# EAGLE schematic Friedman BeOd (EAGLE 9.4.2)
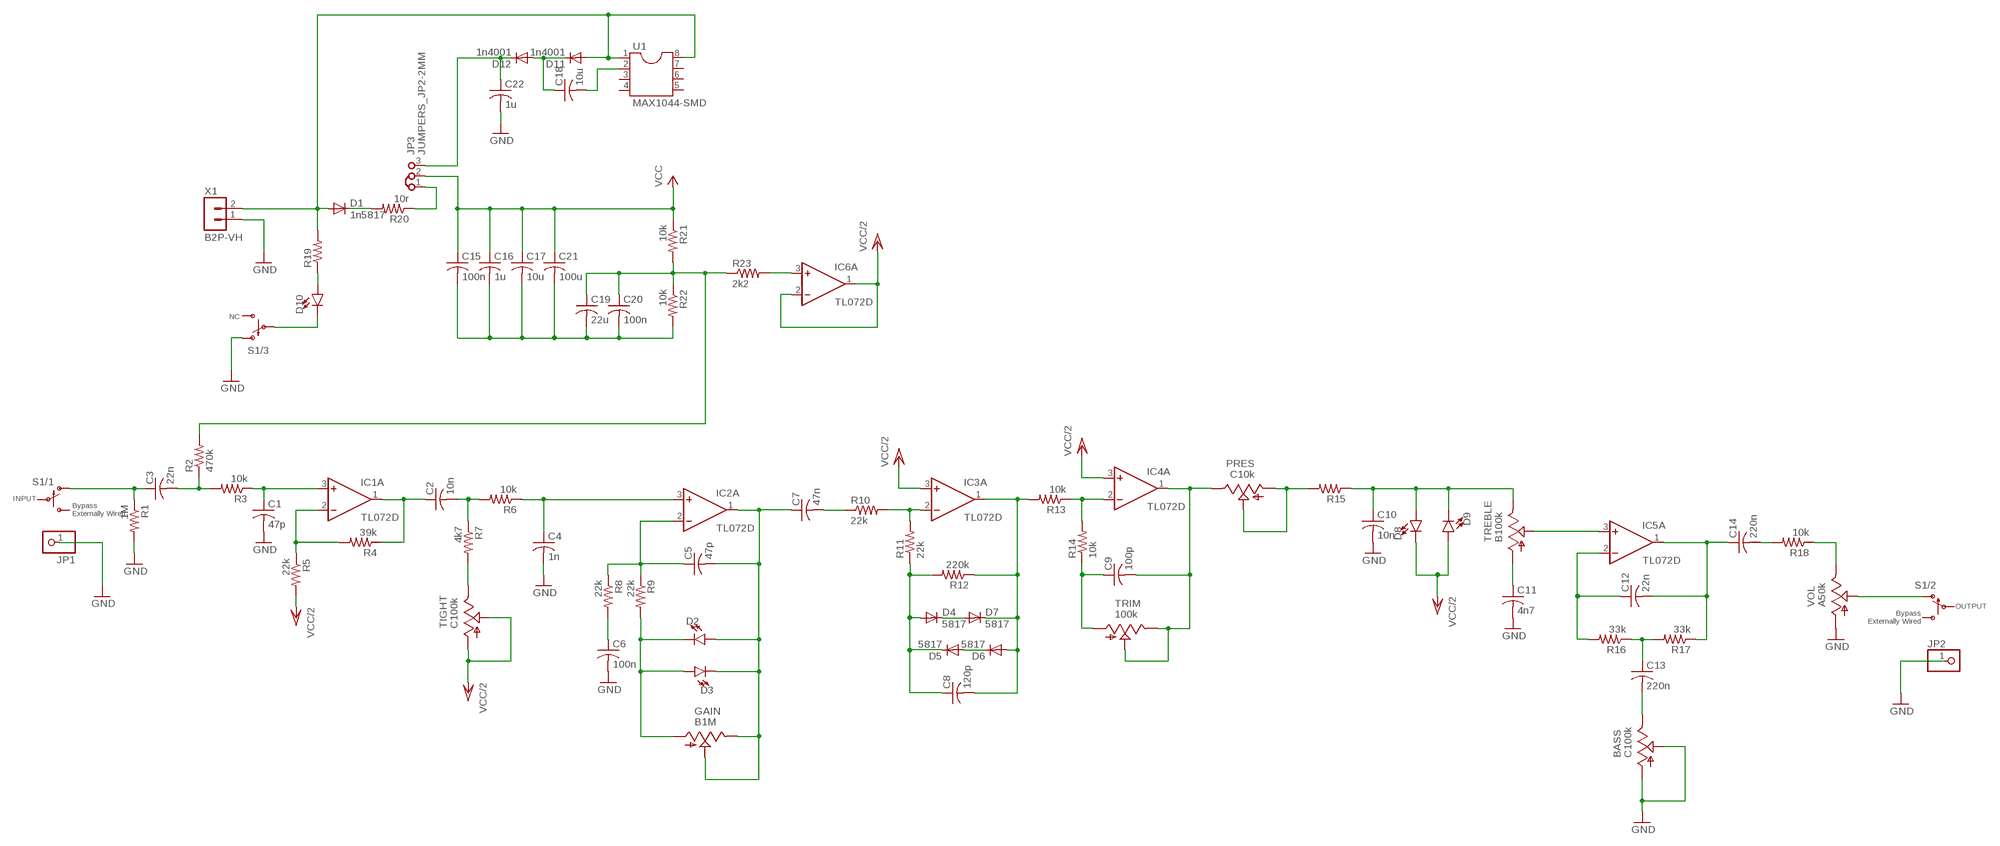
[diagram p0: schematic, sheet 1]

## Parts
BASS  C100k  POT  [61300311121]
C1  47p  C-USC0603  [C0603]
C2  10n  C-USC0603  [C0603]
C3  22n  C-USC0603  [C0603]
C4  1n  C-USC0603  [C0603]
C5  47p  C-USC0603  [C0603]
C6  100n  C-USC0603  [C0603]
C7  47n  C-USC0603  [C0603]
C8  120p  C-USC0603  [C0603]
C9  100p  C-USC0603  [C0603]
C10  10n  C-USC0603  [C0603]
C11  4n7  C-USC0603  [C0603]
C12  22n  C-USC0603  [C0603]
C13  220n  C-USC0603  [C0603]
C14  220n  C-USC0603  [C0603]
C15  100n  C-USC0603  [C0603]
C16  1u  C-USC0603  [C0603]
C17  10u  C-USC0603  [C0603]
C18  10u  C-USC0603  [C0603]
C19  22u  C-USC0603  [C0603]
C20  100n  C-USC0603  [C0603]
C21  100u  C-US075-032X103  [C075-032X103]
C22  1u  C-USC0603  [C0603]
D1  1n5817  1N4004  [DO41-10]
D2  LED3MM  [LED_3MM]
D3  LED3MM  [LED_3MM]
D4  5817  1N4004  [DO41-10]
D5  5817  1N4004  [DO41-10]
D6  5817  1N4004  [DO41-10]
D7  5817  1N4004  [DO41-10]
D8  LED3MM  [LED_3MM]
D9  LED3MM  [LED_3MM]
D10  LED3MM  [LED_3MM]
D11  1n4001  1N4004  [DO41-10]
D12  1n4001  1N4004  [DO41-10]
GAIN  B1M  POT  [61300311121]
IC1  TL072D  [SO08]
IC2  TL072D  [SO08]
IC3  TL072D  [SO08]
IC4  TL072D  [SO08]
IC5  TL072D  [SO08]
IC6  TL072D  [SO08]
JP1  PINHD-1X1  [1X01]
JP2  PINHD-1X1  [1X01]
JP3  JUMPERS_JP2-2MM  [JUMPERS_JP2-2MM]
PRES  C10k  POT  [61300311121]
R1  1M  R-US_R0603  [R0603]
R2  470k  R-US_R0603  [R0603]
R3  10k  R-US_R0603  [R0603]
R4  39k  R-US_R0603  [R0603]
R5  22k  R-US_R0603  [R0603]
R6  10k  R-US_R0603  [R0603]
R7  4k7  R-US_R0603  [R0603]
R8  22k  R-US_R0603  [R0603]
R9  22k  R-US_R0603  [R0603]
R10  22k  R-US_R0603  [R0603]
R11  22k  R-US_R0603  [R0603]
R12  220k  R-US_R0603  [R0603]
R13  10k  R-US_R0603  [R0603]
R14  10k  R-US_R0603  [R0603]
R15  R-US_R0603  [R0603]
R16  33k  R-US_R0603  [R0603]
R17  33k  R-US_R0603  [R0603]
R18  10k  R-US_R0603  [R0603]
R19  R-US_R0603  [R0603]
R20  10r  R-US_R0603  [R0603]
R21  10k  R-US_R0603  [R0603]
R22  10k  R-US_R0603  [R0603]
R23  2k2  R-US_R0603  [R0603]
S1  SWITCH-3DPT-INLINE-BREAKOUT-BYPASS  [1X04]
TIGHT  C100k  POT  [61300311121]
TREBLE  B100k  POT  [61300311121]
TRIM  100k  POT  [61300311121]
U1  MAX1044-SMD  [SO-08]
VOL  A50k  POT  [61300311121]
X1  B2P-VH  [B2P-VH]

## Nets
GND: BASS.1(LEFT) BASS.2(WIPER) C1.2 C4.2 C6.2 C10.2 C11.2 C22.2 JP1.1 JP2.1 R1.2 S1.4(/3:NORMALLY-ON) VOL.1(LEFT) X1.1
N$1: C3.1 R1.1 S1.1(/1:NORMALLY-ON)
N$2: C3.2 R2.1 R3.2
N$3: C1.1 IC1.3(A:+IN) R3.1
N$4: IC1.2(A:-IN) R4.2 R5.1
N$5: C2.1 IC1.1(A:OUT) R4.1
N$6: C2.2 R6.2 R7.1
N$7: R7.2 TIGHT.3(RIGHT)
N$8: S1.2(/2:NORMALLY-ON) VOL.2(WIPER)
N$9: C4.1 IC2.3(A:+IN) R6.1
N$10: C5.1 IC2.2(A:-IN) R8.1 R9.1
N$11: C5.2 C7.1 D2.A D3.K(C) GAIN.2(WIPER) GAIN.3(RIGHT) IC2.1(A:OUT)
N$12: C6.1 R8.2
N$13: D2.K(C) D3.A GAIN.1(LEFT) R9.2
N$14: C8.1 D4.A D5.C R11.1 R12.2
N$15: C7.2 R10.1
N$16: IC3.2(A:-IN) R10.2 R11.2
N$17: C8.2 D6.A D7.C IC3.1(A:OUT) R12.1 R13.2
N$18: D4.C D7.A
N$19: D5.A D6.C
N$20: IC4.2(A:-IN) R13.1 R14.2
N$21: C9.1 R14.1 TRIM.1(LEFT)
N$22: C9.2 IC4.1(A:OUT) PRES.3(RIGHT) TRIM.2(WIPER) TRIM.3(RIGHT)
N$23: PRES.1(LEFT) PRES.2(WIPER) R15.2
N$24: C10.1 D8.A D9.K(C) R15.1 TREBLE.3(RIGHT)
N$25: C11.1 TREBLE.1(LEFT)
N$26: IC5.3(A:+IN) TREBLE.2(WIPER)
N$27: C12.1 IC5.2(A:-IN) R16.2
N$28: C12.2 C14.1 IC5.1(A:OUT) R17.1
N$29: C13.1 R16.1 R17.2
N$30: BASS.3(RIGHT) C13.2
N$31: C14.2 R18.2
N$32: R18.1 VOL.3(RIGHT)
N$33: D10.A R19.1
N$34: D1.C R20.2
N$35: D10.K(C) S1.3(/3:COMMON)
N$36: C15.2 C16.2 C17.2 C19.2 C20.2 C21.2 R22.2
N$37: D1.A D11.A R19.2 U1.1 U1.8 X1.2
N$38: C19.1 C20.1 R2.2 R21.2 R22.1 R23.1
N$39: IC6.3(A:+IN) R23.2
N$40: C18.2 U1.2
N$41: C18.1 D11.C D12.A
N$42: C22.1 D12.C JP3.3
N$43: JP3.1 R20.1
VCC: C15.1 C16.1 C17.1 C21.1 JP3.2 R21.1
VCC/2: D8.K(C) D9.A IC3.3(A:+IN) IC4.3(A:+IN) IC6.1(A:OUT) IC6.2(A:-IN) R5.2 TIGHT.1(LEFT) TIGHT.2(WIPER)
Unconnected: IC1.5(B:+IN) IC1.6(B:-IN) IC1.7(B:OUT) IC2.5(B:+IN) IC2.6(B:-IN) IC2.7(B:OUT) IC3.5(B:+IN) IC3.6(B:-IN) IC3.7(B:OUT) IC4.5(B:+IN) IC4.6(B:-IN) IC4.7(B:OUT) IC5.5(B:+IN) IC5.6(B:-IN) IC5.7(B:OUT) IC6.5(B:+IN) IC6.6(B:-IN) IC6.7(B:OUT) U1.3 U1.4 U1.5 U1.6 U1.7

## Power pins joined to a net without a drawn wire
V+: IC1.8(P:V+) IC2.8(P:V+) IC3.8(P:V+) IC4.8(P:V+) IC5.8(P:V+) IC6.8(P:V+)
V-: IC1.4(P:V-) IC2.4(P:V-) IC3.4(P:V-) IC4.4(P:V-) IC5.4(P:V-) IC6.4(P:V-)

## Library data of the parts
BASS GAIN PRES TIGHT TREBLE TRIM VOL = pedalPartsLibrary:POT
C1-C22 = rcl:C-US: CAPACITOR, American symbol; SPICEPREFIX: C
D1 D4-D7 D11 D12 = adafruit:1N4004: DIODE General purpose 1N400x type rectifier (With bigger pads) http://www.ladyada.net/library/pcb/eaglelibrary.html
D2 D3 D8-D10 = SparkFun-LED:LED: LED (Generic) Standard schematic elements and footprints for 5mm, 3mm, 1206, and 0603 sized LEDs. Generic LEDs with no color specified.; PROD_ID: DIO-08794
IC1-IC6 = linear:TL072: OP AMP
JP1 JP2 = adafruit:PINHD-1X1: Pin header 1x1 for 0.1" spacing With round pins
JP3 = 52101-101-REV-A:JUMPERS_JP2-: Jumper/Bridge
R1-R23 = rcl:R-US_: RESISTOR, American symbol; SPICEPREFIX: R
S1 = pedalPartsLibrary:SWITCH-3DPT-INLINE-BREAKOUT-BYPASS
U1 = pedalPartsLibrary:MAX1044-SMD
X1 = con-JST VH:B2P-VH: JST VH Series header 3.96mm pitch disconnectable crimp style connectors, vertical (side entry type), 2 pins